# EAGLE design garden_sensor (EAGLE 5.06)
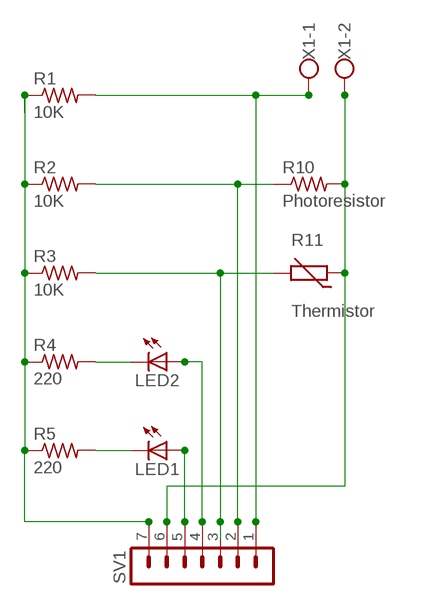
[diagram p0: schematic, sheet 1]

## Parts
LED1  LED5MM  [LED5MM]
LED2  LED5MM  [LED5MM]
R1  10K  R-US_0204/7  [0204/7]
R2  10K  R-US_0204/7  [0204/7]
R3  10K  R-US_0204/7  [0204/7]
R4  220  R-US_0204/7  [0204/7]
R5  220  R-US_0204/7  [0204/7]
R10  Photoresistor  R-US_0204/7  [0204/7]
R11  Thermistor  THERMISTOR-5  [R-5]
SV1  MA07-1  [MA07-1]
X1  W237-102  [W237-102]

## Nets
N$1: R1.1 R2.1 R3.1 R4.1 R5.1 SV1.7
N$2: LED2.K(C) R4.2
N$3: LED1.K(C) R5.2
N$4: LED2.A SV1.4
N$5: R3.2 R11.2 SV1.3
N$6: R2.2 R10.1 SV1.2
N$7: LED1.A SV1.5
N$8: R1.2 SV1.1 X1.1
N$13: R10.2 R11.1 SV1.6 X1.2

## Library data of the parts
LED1 LED2 = led:LED: LED OSRAM: - CHIPLED LG R971, LG N971, LY N971, LG Q971, LY Q971, LO R971, LY R971 LH N974, LH R974 LS Q976, LO Q976, LY Q976 LO Q996 - Hyper CHIPLED LW Q18S LB Q993, LB Q99A, LB R99A - SideLED LS A670, LO A670, LY A670, LG A670, LP A670 LB A673, LV A673, LT A673, LW A673 LH A674 LY A675 LS A676, LA A676, LO A676, LY A676, LW A676 LS A679, LY A679, LG A679 - Hyper Micro SIDELED® LS Y876, LA Y876, LO Y876, LY Y876 LT Y87S - SmartLED LW L88C, LW L88S LB L89C, LB L89S, LG L890 LS L89K, LO L89K, LY L89K LS L896, LA L896, LO L896, LY L896 - TOPLED LS T670, LO T670, LY T670, LG T670, LP T670 LSG T670, LSP T670, LSY T670, LOP T670, LYG T670 LG T671, LOG T671, LSG T671 LB T673, LV T673, LT T673, LW T673 LH T674 LS T676, LA T676, LO T676, LY T676, LB T676, LH T676, LSB T676, LW T676 LB T67C, LV T67C, LT T67C, LS T67K, LO T67K, LY T67K, LW E67C LS E67B, LA E67B, LO E67B, LY E67B, LB E67C, LV E67C, LT E67C LW T67C LS T679, LY T679, LG T679 LS T770, LO T770, LY T770, LG T770, LP T770 LB T773, LV T773, LT T773, LW T773 LH T774 LS E675, LA E675, LY E675, LS T675 LS T776, LA T776, LO T776, LY T776, LB T776 LHGB T686 LT T68C, LB T68C - Hyper Mini TOPLED® LB M676 - Mini TOPLED Santana® LG M470 LS M47K, LO M47K, LY M47K Source: http://www.osram.convergy.de LUXEON: - LUMILED® LXK2-PW12-R00, LXK2-PW12-S00, LXK2-PW14-U00, LXK2-PW14-V00 LXK2-PM12-R00, LXK2-PM12-S00, LXK2-PM14-U00 LXK2-PE12-Q00, LXK2-PE12-R00, LXK2-PE12-S00, LXK2-PE14-T00, LXK2-PE14-U00 LXK2-PB12-K00, LXK2-PB12-L00, LXK2-PB12-M00, LXK2-PB14-N00, LXK2-PB14-P00, LXK2-PB14-Q00 LXK2-PR12-L00, LXK2-PR12-M00, LXK2-PR14-Q00, LXK2-PR14-R00 LXK2-PD12-Q00, LXK2-PD12-R00, LXK2-PD12-S00 LXK2-PH12-R00, LXK2-PH12-S00 LXK2-PL12-P00, LXK2-PL12-Q00, LXK2-PL12-R00 Source: www.luxeon.com KINGBRIGHT: KA-3528ASYC Source: www.kingbright.com
R1-R5 R10 = resistor:R-US_: RESISTOR, American symbol
R11 = varistor:THERMISTOR: THERMISTOR
SV1 = con-lstb:MA07-1: PIN HEADER
X1 = con-wago-500:W237-102: WAGO SCREW CLAMP

## Board
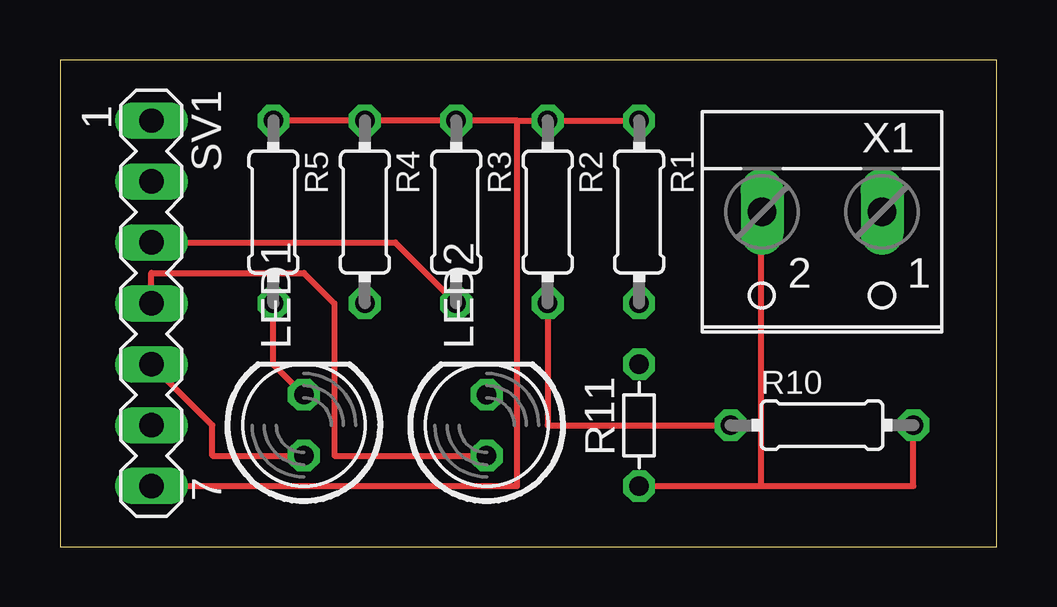
[diagram p1: board, top side]
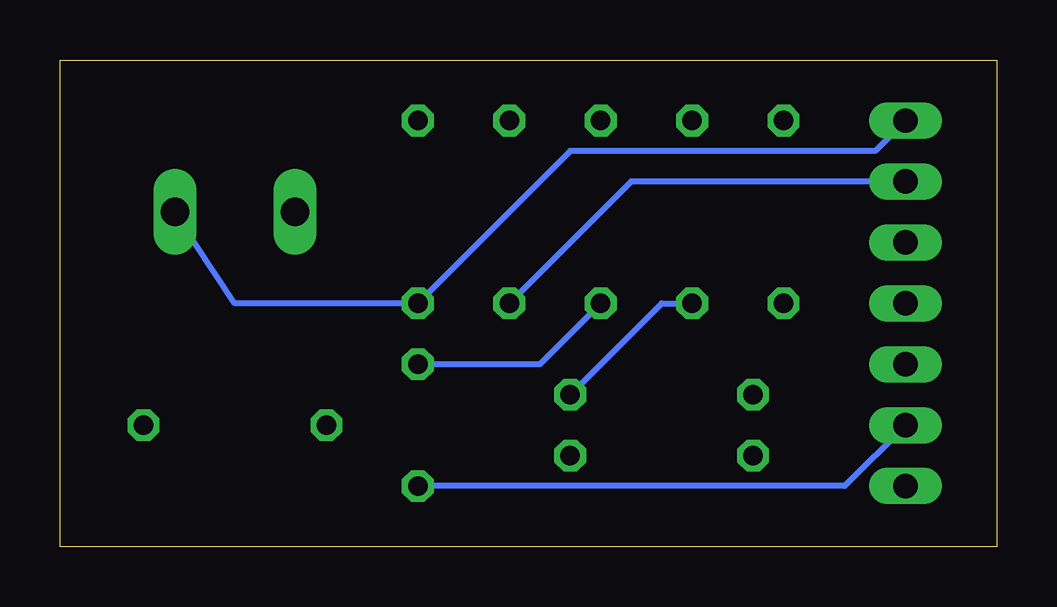
[diagram p2: board, bottom side, seen from below]

Size 39.04 x 20.31 mm. Coordinates in mm from the lower left corner, seen from the top.
Outline: 0,0 39.04,0 39.04,20.31 0,20.31 0,0
Copper layers (1*16): Top 0.035mm / dielectric 1.5mm / Bottom 0.035mm
Design rules "default": minimum track width 10mil, minimum drill 24mil, track to track 8mil, track to pad 8mil, pad to pad 8mil, via to via 8mil, smd to smd 8mil, copper to edge 40mil, drill to drill 8mil, minimum pad ring 10mil, minimum via ring 8mil, stop-mask expansion 4mil, vias tented up to drill 0mil, thermal gap 10mil

### Footprints (pad centres in the part's own frame; a part is rotated, then mirrored left to right if it is on the bottom)
LED5MM = drill 0.813 octagon: A -1.27,0; K 1.27,0
0204/7 = drill 0.813 octagon: 1 -3.81,0; 2 3.81,0
R-5 = drill 0.813 octagon: 1 -2.54,0; 2 2.54,0
MA07-1 = drill 1.016 long: 1 -7.62,0; 2 -5.08,0; 3 -2.54,0; 4 0,0; 5 2.54,0; 6 5.08,0; 7 7.62,0
W237-102 = drill 1.194 long: 1 -2.5,-1.27; 2 2.5,-1.27

### Placement (x,y rotation side)
LED1  10.16,5.08 90 top
LED2  17.78,5.08 90 top
R1  24.13,13.97 270 top
R2  20.32,13.97 270 top
R3  16.51,13.97 270 top
R4  12.7,13.97 270 top
R5  8.89,13.97 270 top
R10  31.75,5.08 0 top
R11  24.13,5.08 90 top
SV1  3.81,10.16 270 top
X1  31.75,12.7 180 top

### Tracks (layer width: path | path; a pad name or v marks a point on that pad's centre or on a via)
N$1
  Top 0.254: R5.1 R4.1 R3.1 19.05,17.78 | R1.1 R2.1 19.05,17.78 | SV1.7 19.05,2.54 19.05,17.78
N$2
  Bottom 0.254: LED2.K 13.97,10.16 R4.2
N$3
  Top 0.254: LED1.K 8.89,7.62 R5.2
N$4
  Top 0.254: LED2.A 11.43,3.81 11.43,10.16 10.16,11.43 3.81,11.43 SV1.4
N$5
  Top 0.254: SV1.3 13.97,12.7 R3.2
  Bottom 0.254: R3.2 19.05,7.62 R11.2
N$6
  Top 0.254: R10.1 20.32,5.08 R2.2
  Bottom 0.254: R2.2 15.24,15.24 SV1.2
N$7
  Top 0.254: LED1.A 6.35,3.81 6.35,5.08 SV1.5
N$8
  Bottom 0.254: X1.1 34.29,13.97 31.75,10.16 R1.2 17.78,16.51 5.08,16.51 SV1.1
N$13
  Top 0.254: 29.21,2.54 35.56,2.54 R10.2 | R11.1 29.21,2.54 | 29.21,2.54 29.21,13.97 X1.2
  Bottom 0.254: SV1.6 6.35,2.54 R11.1